# EAGLE design luxeon_r1 (EAGLE 5.08)
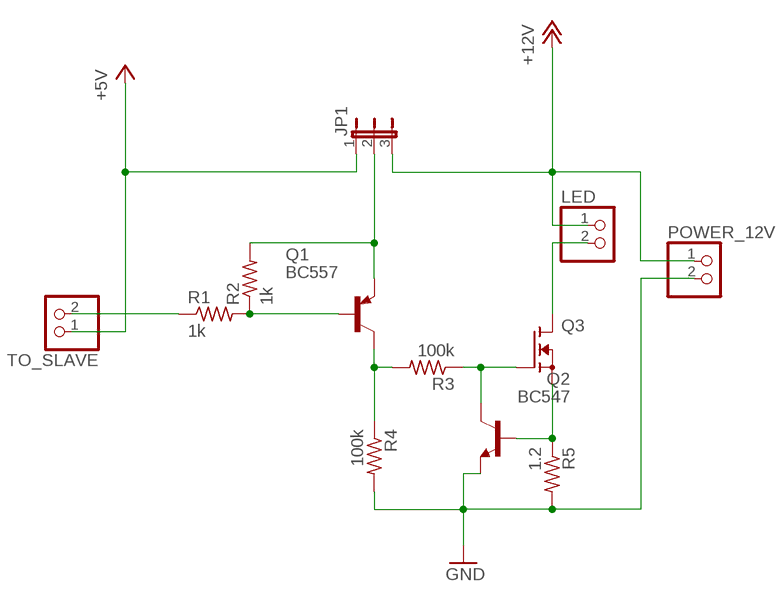
[diagram p0: schematic, sheet 1]

## Parts
JP1  JP2E  [JP2]
LED  PINHD-1X2  [1X02]
POWER_12V  PINHD-1X2  [1X02]
Q1  BC557  [TO92]
Q2  BC547  [TO92]
Q3  TOSHIBA-2SK4033  [TO252]
R1  1k  R-US_0204/7  [0204/7]
R2  1k  R-US_0204/7  [0204/7]
R3  100k  R-US_0204/7  [0204/7]
R4  100k  R-US_0204/7  [0204/7]
R5  1.2  R-US_0204/7  [0204/7]
TO_SLAVE  PINHD-1X2  [1X02]

## Nets
+5V: JP1.1 TO_SLAVE.1
+12V: JP1.3 LED.1 POWER_12V.1
DISSIPATE: LED.2 Q3.3(D)
GND: POWER_12V.2 Q2.1(E) R4.2 R5.2
N$1: Q1.2(B) R1.2 R2.1
N$2: Q2.3(C) Q3.1(G) R3.1
N$3: Q1.3(C) R3.2 R4.1
N$4: Q2.2(B) Q3.2(S) R5.1
N$5: JP1.2 Q1.1(E) R2.2
N$6: R1.1 TO_SLAVE.2

## Library data of the parts
JP1 = jumper:JP2E: JUMPER
LED POWER_12V TO_SLAVE = pinhead:PINHD-1X2: PIN HEADER
Q1 = transistor-pnp:BC557: PNP Transistor
Q2 = transistor:BC547: NPN TRANSISTOR
Q3 = damians_bits:TOSHIBA-2SK4033: TOSHIBA 2SK4033 Field Effect Transistor N-Channel MOSFET
R1-R5 = rcl:R-US_: RESISTOR, American symbol

## Board
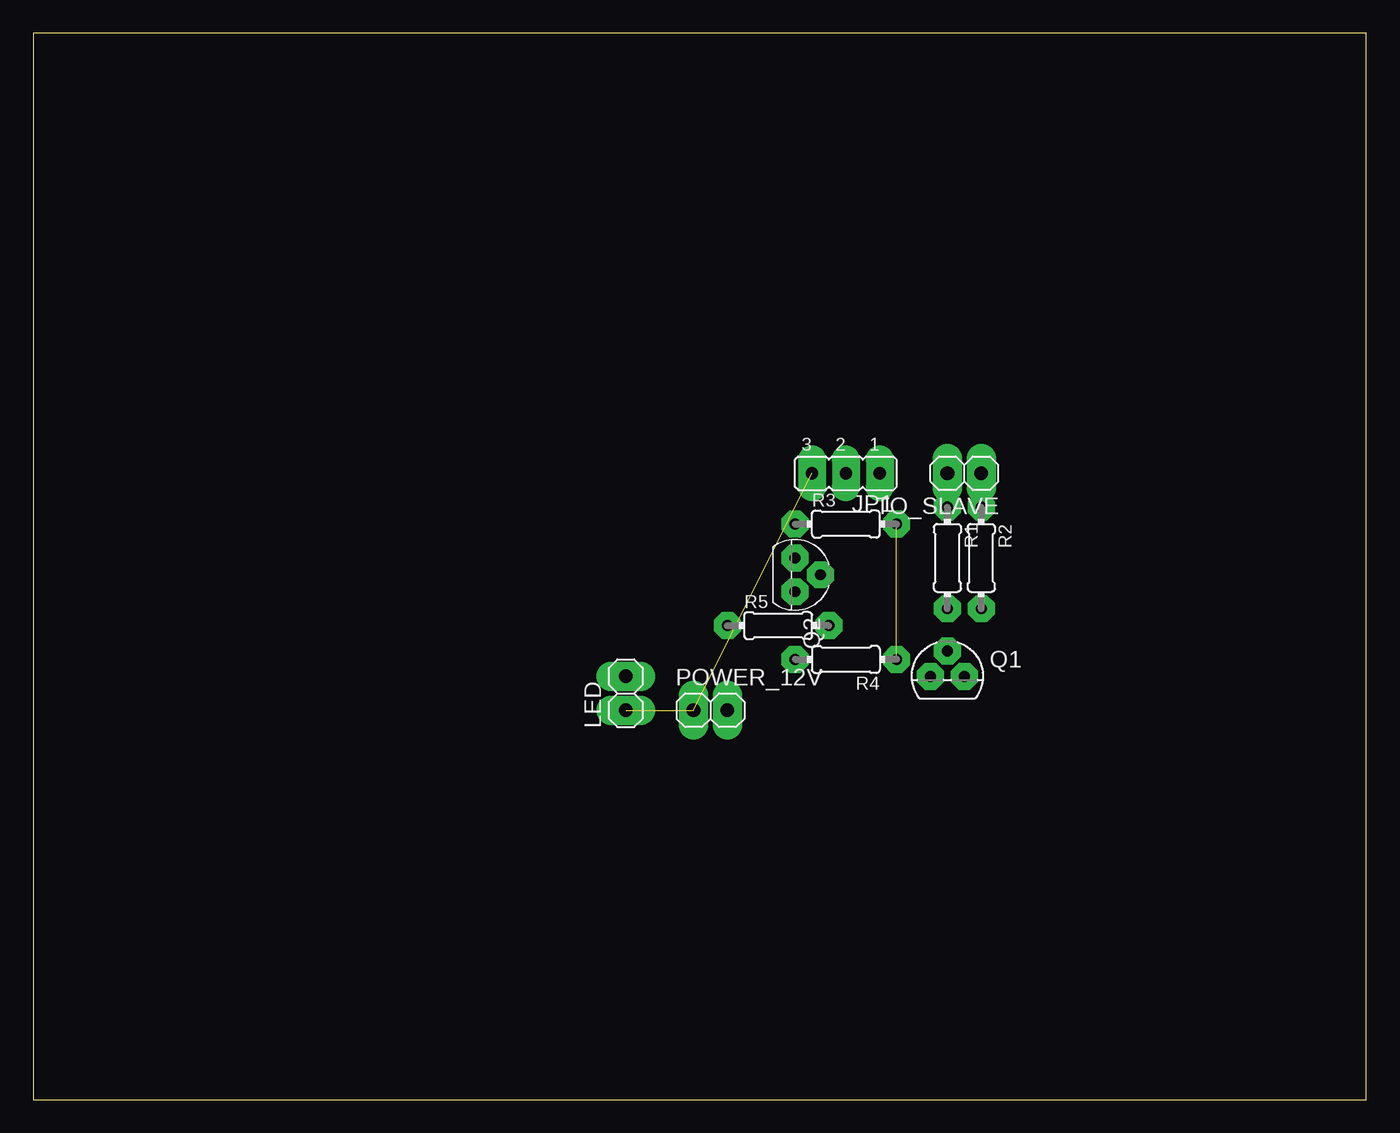
[diagram p1: board, top side]
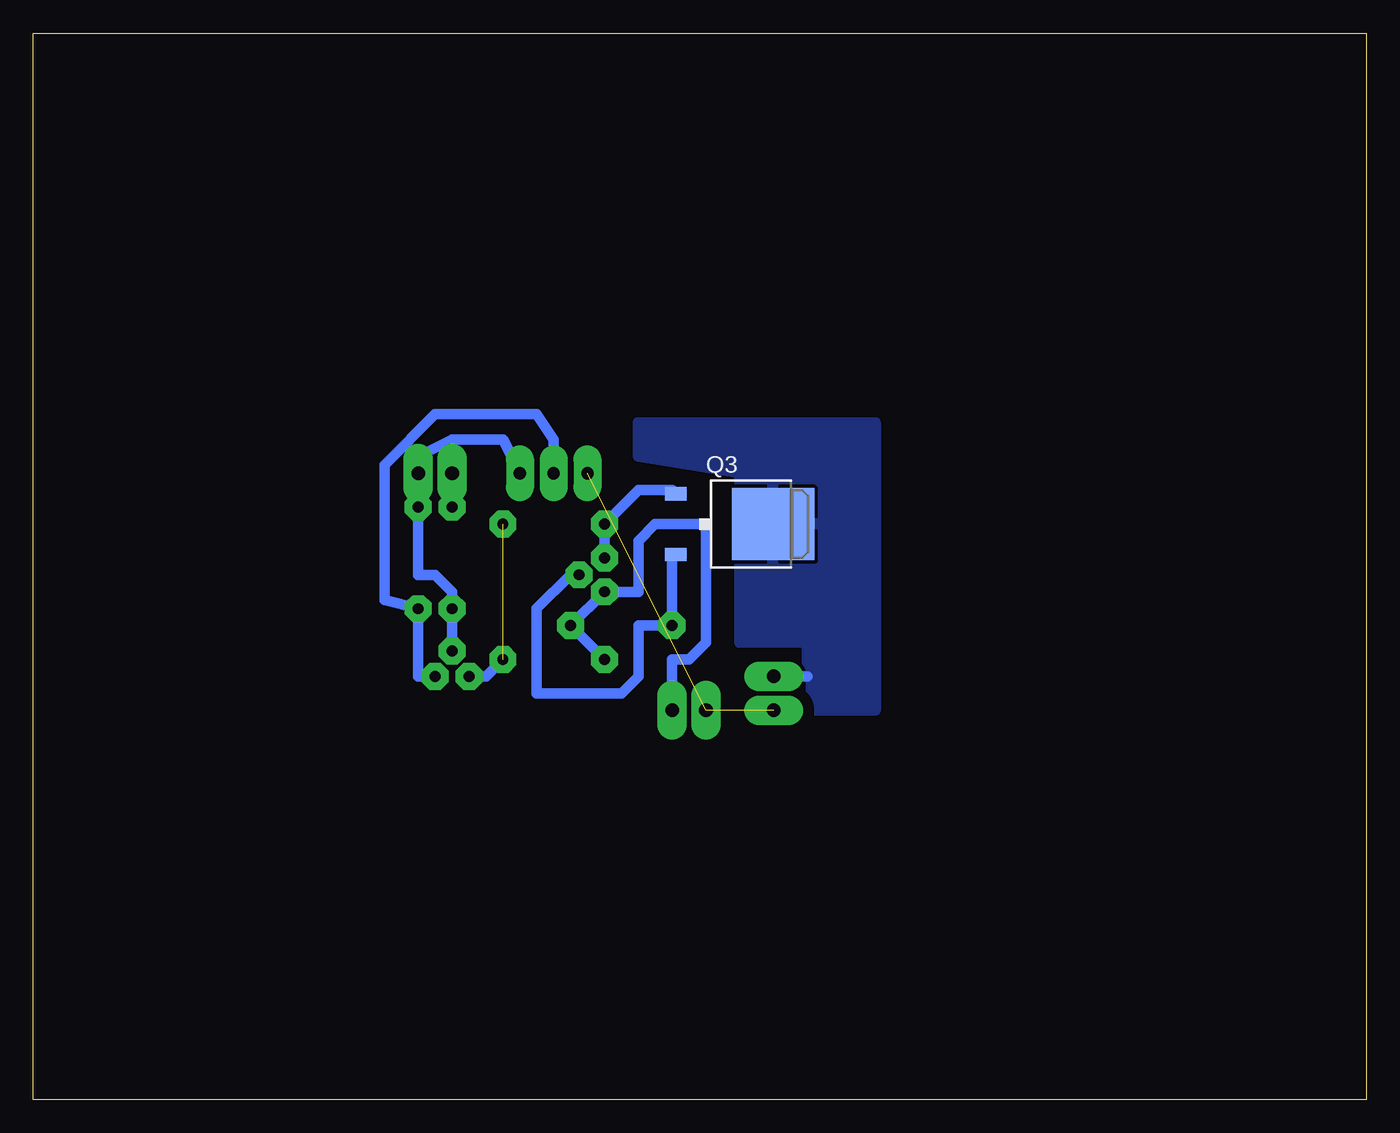
[diagram p2: board, bottom side, seen from below]

Size 100 x 80 mm. Coordinates in mm from the lower left corner, seen from the top.
Outline: 0,0 100,0 100,80 0,80 0,0
Copper layers (1*16): Top 0.035mm / dielectric 1.5mm / Bottom 0.035mm
Design rules "default": minimum track width 0.8mm, minimum drill 0.8mm, track to track 0.8mm, track to pad 0.8mm, pad to pad 0.45mm, via to via 0.8mm, smd to smd 8mil, copper to edge 10mil, drill to drill 8mil, minimum pad ring 0.6mm, minimum via ring 0.6mm, stop-mask expansion 0mil, vias tented up to drill 0mil, thermal gap 10mil

### Footprints (pad centres in the part's own frame; a part is rotated, then mirrored left to right if it is on the bottom)
JP2 = drill 0.914 long: 1 -2.54,0; 2 0,0; 3 2.54,0
1X02 = drill 1.016 long: 1 -1.27,0; 2 1.27,0
TO92 = drill 0.813 octagon: 1 1.27,0; 2 0,1.905; 3 -1.27,0
TO252 = smd 1 x 1.6: 1 -2.28,-4.8; 2 2.28,-4.8 | smd 5.4 x 6.2: 3 0,2.5
0204/7 = drill 0.813 octagon: 1 -3.81,0; 2 3.81,0

### Placement (x,y rotation side)
JP1  60.96,46.99 180 top
LED  44.45,30.48 90 top
POWER_12V  50.8,29.21 0 top
Q1  68.58,31.75 0 top
Q2  57.15,39.37 270 top
Q3  46.99,43.18 270 bottom
R1  68.58,40.64 270 top
R2  71.12,40.64 270 top
R3  60.96,43.18 0 top
R4  60.96,33.02 180 top
R5  55.88,35.56 0 top
TO_SLAVE  69.85,46.99 180 top

### Tracks (layer width: path | path; a pad name or v marks a point on that pad's centre or on a via)
+5V
  Bottom 0.8: JP1.1 64.77,49.53 68.58,49.53 71.12,48.26 TO_SLAVE.1
+12V  (2 unrouted)
DISSIPATE
  Bottom 0.8: Q3.3 44.45,43.18 | 41.91,31.75 LED.2
  pour Bottom: 46.99,34.29 46.99,46.99 54.61,48.26 54.61,50.8 36.83,50.8 36.83,29.21 41.91,29.21 41.91,34.29
GND
  Bottom 0.8: R4.2 R5.2 Q2.1 54.61,38.1 54.61,41.91 53.34,43.18 49.53,43.18 49.53,34.29 50.8,33.02 52.07,33.02 POWER_12V.2
N$1
  Bottom 0.8: Q1.2 R1.2 68.58,38.1 69.85,39.37 71.12,39.37 R2.1
N$2
  Bottom 0.8: Q3.1 52.07,45.72 54.61,45.72 R3.1 Q2.3
N$3  (1 unrouted)
  Bottom 0.8: R4.1 66.04,31.75 Q1.3
N$4
  Bottom 0.8: Q3.2 52.07,40.64 R5.1 54.61,35.56 54.61,31.75 55.88,30.48 62.23,30.48 62.23,36.83 59.69,39.37 Q2.2
N$5
  Bottom 0.8: Q1.1 71.12,31.75 R2.2 73.66,37.47 73.66,47.62 69.85,51.44 62.23,51.44 60.96,49.53 JP1.2
N$6
  Bottom 0.8: R1.1 TO_SLAVE.2